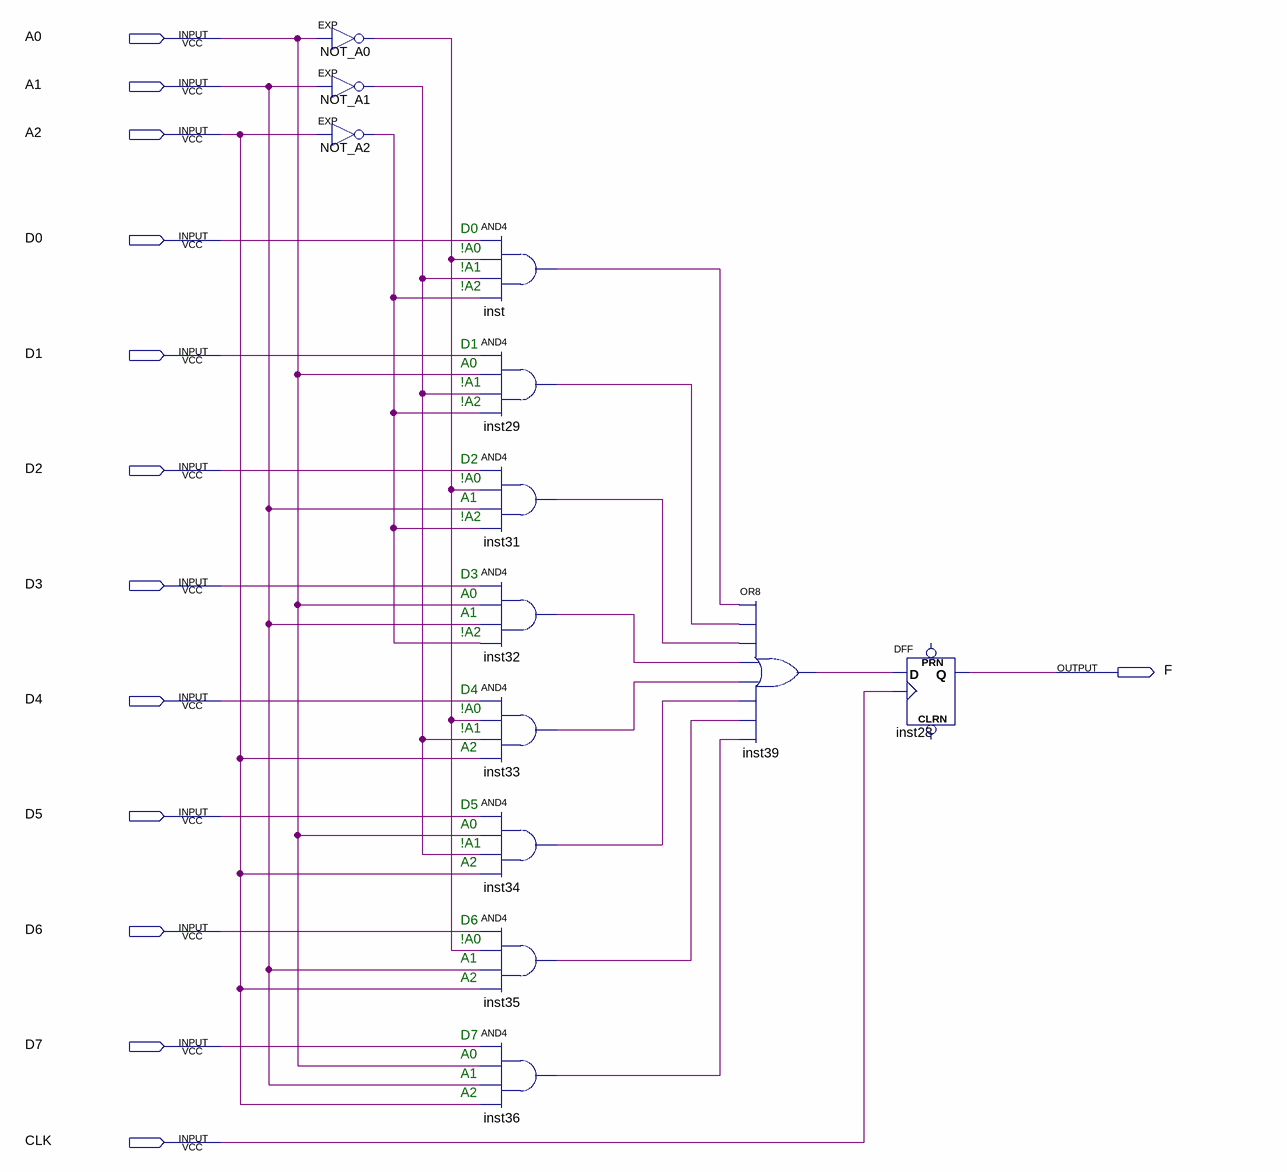
[diagram p0: schematic sheet]
// Quartus schematic Lab1_mux.bdf as structural Verilog: 13 symbols, 13 pins
module Lab1_mux (
  input  A0,
  input  A1,
  input  A2,
  input  D0,
  input  D1,
  input  D2,
  input  D3,
  input  D4,
  input  D5,
  input  D6,
  input  D7,
  input  CLK,
  output F
);

  wire inst29_out, inst31_out, inst32_out, inst33_out, inst34_out, inst35_out, inst36_out, inst39_out,
       inst_out, NOT_A0_out, NOT_A1_out, NOT_A2_out;

  EXP NOT_A0 (.IN(A0), .OUT(NOT_A0_out));
  EXP NOT_A1 (.IN(A1), .OUT(NOT_A1_out));
  EXP NOT_A2 (.IN(A2), .OUT(NOT_A2_out));
  and inst (inst_out, D0, NOT_A0_out, NOT_A1_out, NOT_A2_out);
  and inst29 (inst29_out, D1, A0, NOT_A1_out, NOT_A2_out);
  and inst31 (inst31_out, D2, NOT_A0_out, A1, NOT_A2_out);
  and inst32 (inst32_out, D3, A0, A1, NOT_A2_out);
  and inst33 (inst33_out, D4, NOT_A0_out, NOT_A1_out, A2);
  and inst34 (inst34_out, D5, A0, NOT_A1_out, A2);
  and inst35 (inst35_out, D6, NOT_A0_out, A1, A2);
  and inst36 (inst36_out, D7, A0, A1, A2);
  or inst39 (inst39_out, inst_out, inst29_out, inst31_out, inst32_out, inst33_out, inst34_out, inst35_out, inst36_out);
  DFF inst28 (.CLK(CLK), .D(inst39_out), .Q(F));  // open: CLRN, PRN

  // Notes on the sheet:
  //   D0
  //   !A0
  //   !A1
  //   !A2
  //   D1
  //   A0
  //   !A1
  //   !A2
  //   D2
  //   !A0
  //   A1
  //   !A2
  //   D3
  //   A0
  //   A1
  //   !A2
  //   D4
  //   !A0
  //   !A1
  //   A2
  //   D5
  //   A0
  //   !A1
  //   A2
  //   D6
  //   !A0
  //   A1
  //   A2
  //   D7
  //   A0
  //   A1
  //   A2
endmodule
